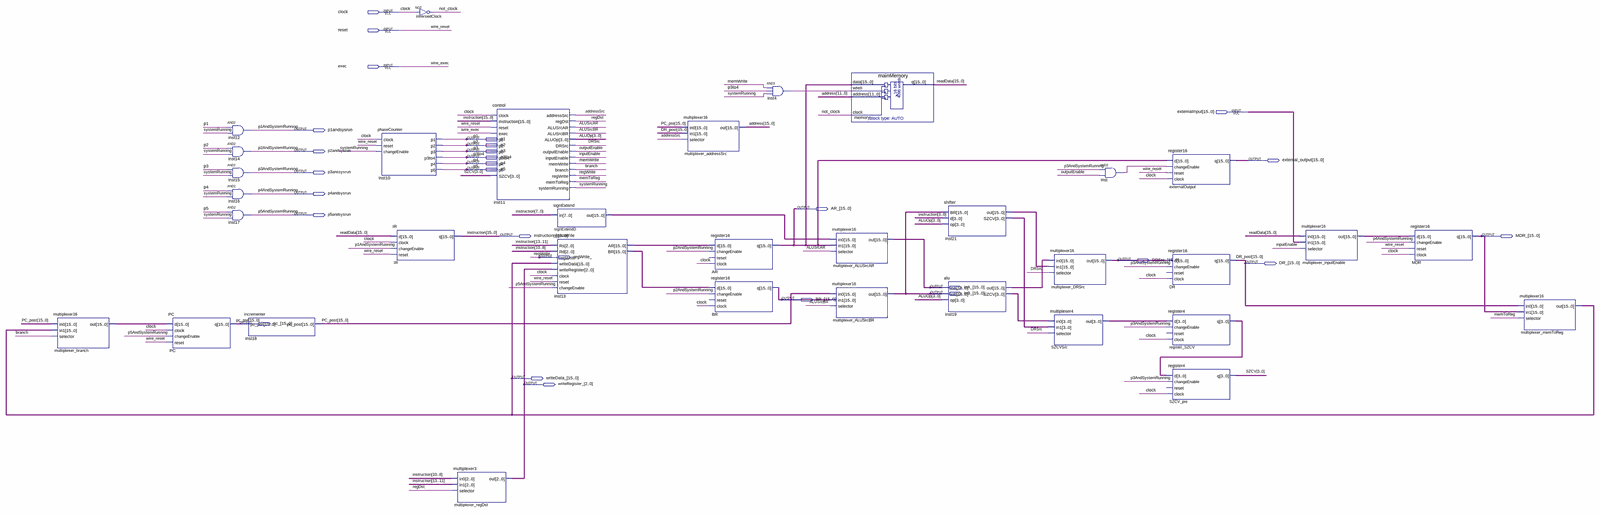
[diagram p0: schematic sheet, whole]
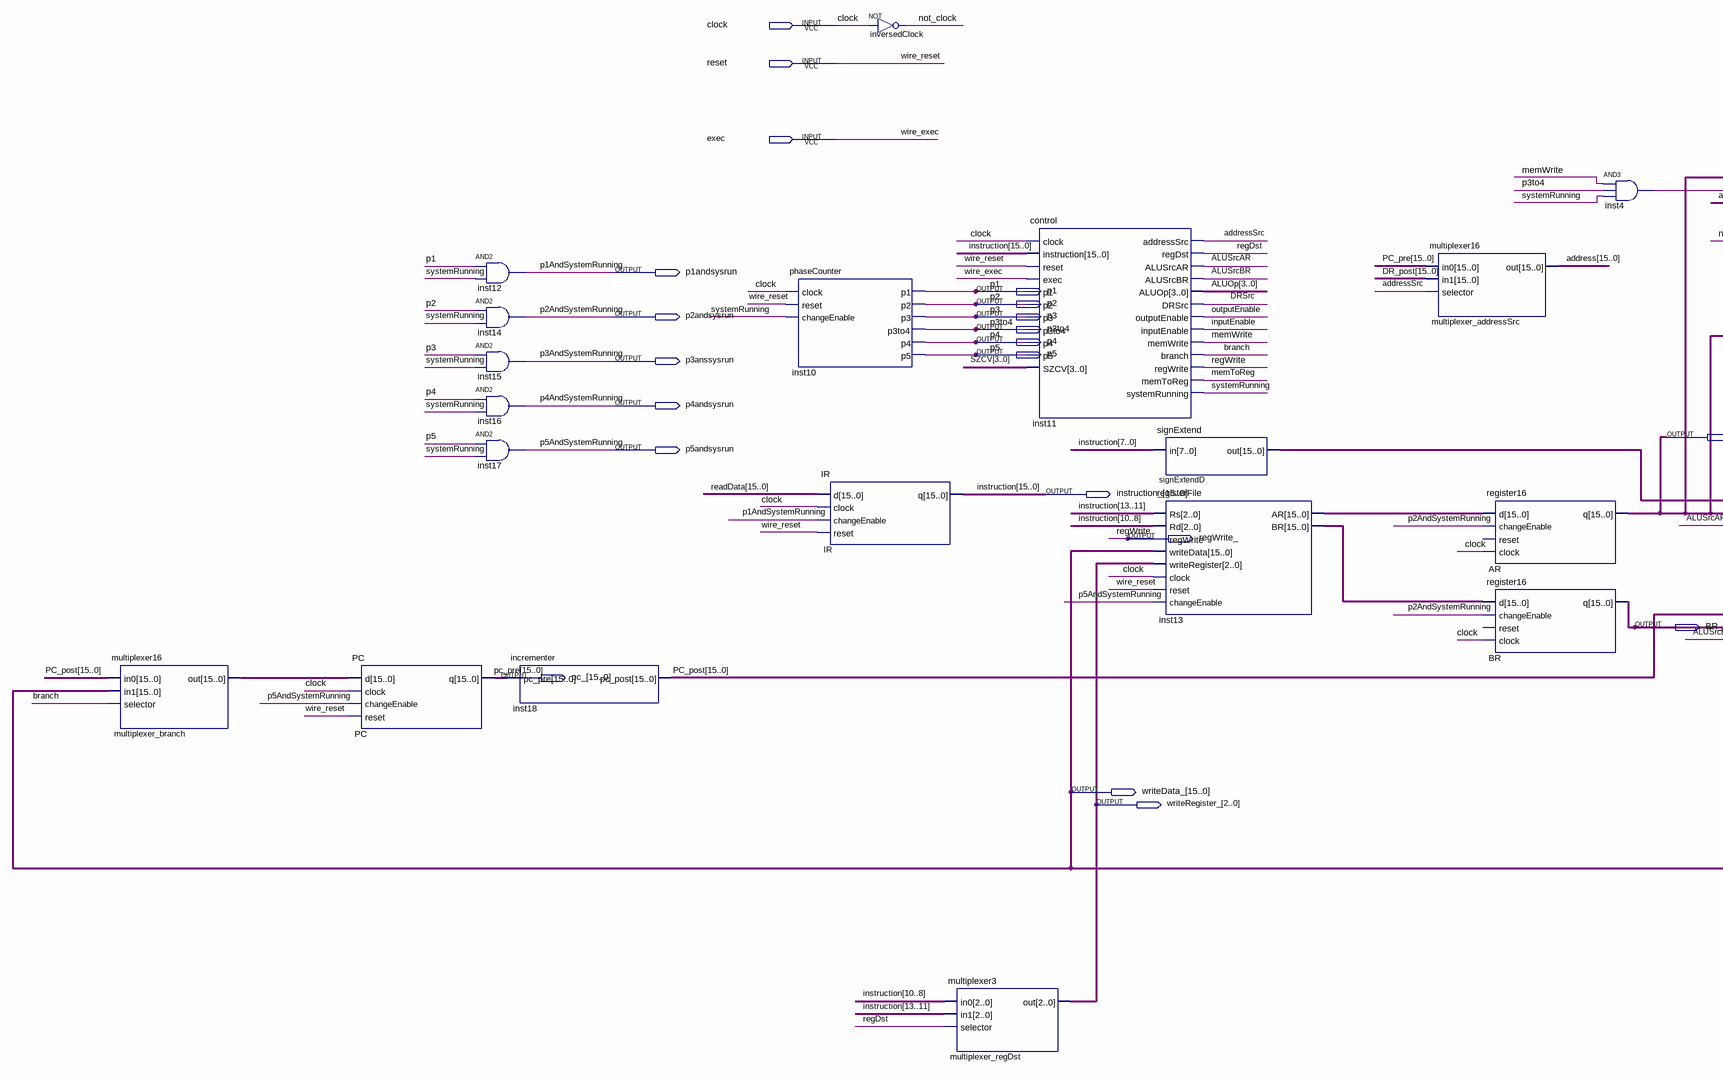
[diagram p1: schematic sheet, left part]
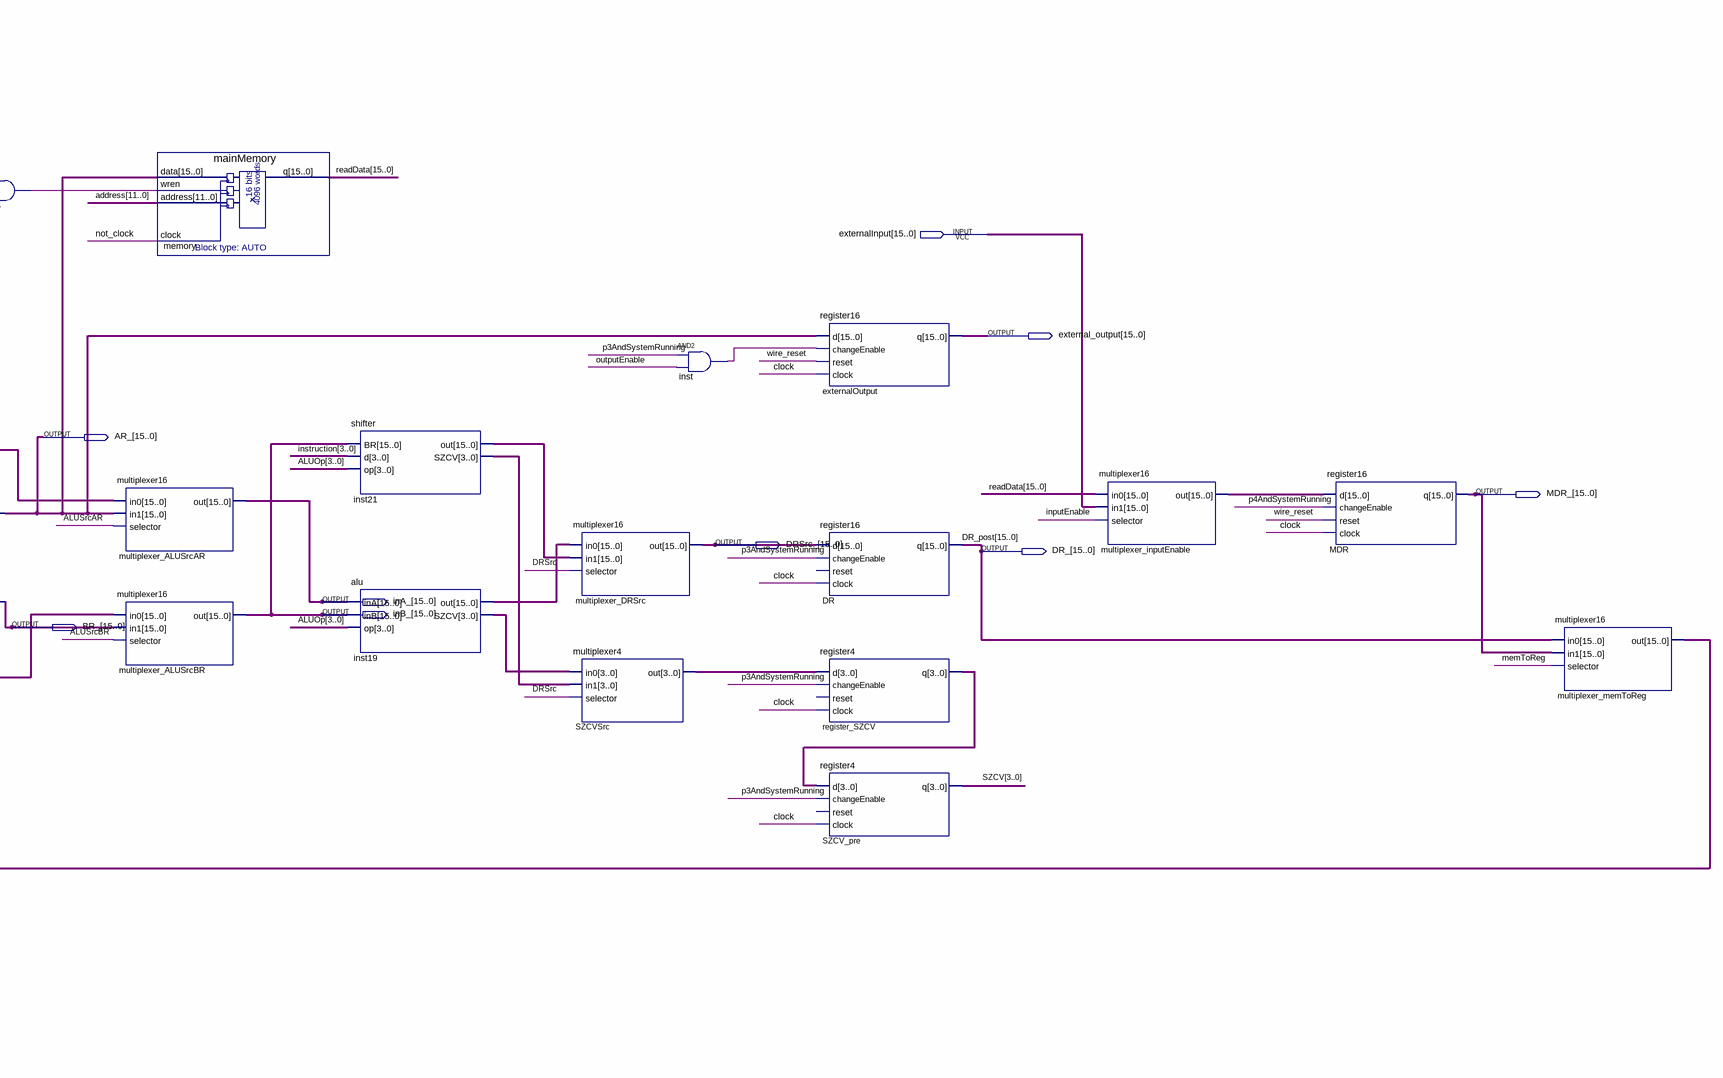
[diagram p2: schematic sheet, right part]
// Quartus schematic processor.bdf as structural Verilog: 34 symbols, 28 pins
module processor (
  input  clock,
  input  reset,
  input  exec,
  input  [15:0] externalInput,
  output p1andsysrun,
  output p1,
  output p2,
  output p2andsysrun,
  output p3,
  output p3to4,
  output [15:0] external_output,
  output p4,
  output p5,
  output p3anssysrun,
  output p4andsysrun,
  output [15:0] AR_,
  output p5andsysrun,
  output [15:0] instruction_,
  output [15:0] MDR_,
  output regWrite_,
  output [15:0] DRSrc_,
  output [15:0] DR_,
  output [15:0] inA_,
  output [15:0] inB_,
  output [15:0] BR_,
  output [15:0] pc_,
  output [15:0] writeData_,
  output [2:0] writeRegister_
);

  wire addressSrc, ALUSrcAR, ALUSrcBR, branch, DRSrc, inputEnable, inst4_out, inst_out, memToReg, memWrite,
       not_clock, outputEnable, regDst, systemRunning;
  wire [3:0] ALUOp, inst19_szcv, inst21_szcv, register_SZCV_q, SZCV, SZCVSrc_out;
  wire [15:0] address, inst13_ar, inst13_br, inst19_out, inst21_out, multiplexer_branch_out,
       multiplexer_inputEnable_out, PC_post, readData, signExtendD_out;

  multiplexer16 multiplexer_branch (.in0(PC_post), .in1(writeData_), .selector(branch), .out(multiplexer_branch_out));
  PC PC (.d(multiplexer_branch_out), .clock(clock), .changeEnable(p5andsysrun), .reset(reset), .q(pc_));
  and inst12 (p1andsysrun, p1, systemRunning);
  and inst14 (p2andsysrun, p2, systemRunning);
  and inst15 (p3anssysrun, p3, systemRunning);
  and inst16 (p4andsysrun, p4, systemRunning);
  and inst17 (p5andsysrun, p5, systemRunning);
  incrementer inst18 (.pc_pre(pc_), .pc_post(PC_post));
  phaseCounter inst10 (
    .clock(clock), .reset(reset), .changeEnable(systemRunning), .p1(p1), .p2(p2), .p3(p3), .p3to4(p3to4),
    .p4(p4), .p5(p5));
  IR IR (.d(readData), .clock(clock), .changeEnable(p1andsysrun), .reset(reset), .q(instruction_));
  not inversedClock (not_clock, clock);
  multiplexer3 multiplexer_regDst (
    .in0(instruction_[10:8]), .in1(instruction_[13:11]), .selector(regDst), .out(writeRegister_));
  control inst11 (
    .clock(clock), .instruction(instruction_), .reset(reset), .exec(exec), .p1(p1), .p2(p2), .p3(p3),
    .p3to4(p3to4), .p4(p4), .p5(p5), .SZCV(SZCV), .addressSrc(addressSrc), .regDst(regDst),
    .ALUSrcAR(ALUSrcAR), .ALUSrcBR(ALUSrcBR), .ALUOp(ALUOp), .DRSrc(DRSrc), .outputEnable(outputEnable),
    .inputEnable(inputEnable), .memWrite(memWrite), .branch(branch), .regWrite(regWrite_),
    .memToReg(memToReg), .systemRunning(systemRunning));
  signExtend signExtendD (.in(instruction_[7:0]), .out(signExtendD_out));
  registerFile inst13 (
    .Rs(instruction_[13:11]), .Rd(instruction_[10:8]), .regWrite(regWrite_), .writeData(writeData_),
    .writeRegister(writeRegister_), .clock(clock), .reset(reset), .changeEnable(p5andsysrun), .AR(inst13_ar),
    .BR(inst13_br));
  multiplexer16 multiplexer_addressSrc (.in0(pc_), .in1(DR_), .selector(addressSrc), .out(address));
  register16 AR (.d(inst13_ar), .changeEnable(p2andsysrun), .clock(clock), .q(AR_));  // open: reset
  register16 BR (.d(inst13_br), .changeEnable(p2andsysrun), .clock(clock), .q(BR_));  // open: reset
  and inst4 (inst4_out, memWrite, p3to4, systemRunning);
  multiplexer16 multiplexer_ALUSrcAR (.in0(signExtendD_out), .in1(AR_), .selector(ALUSrcAR), .out(inA_));
  multiplexer16 multiplexer_ALUSrcBR (.in0(PC_post), .in1(BR_), .selector(ALUSrcBR), .out(inB_));
  mainMemory memory (.data(AR_), .wren(inst4_out), .address(address[11:0]), .clock(not_clock), .q(readData));
  shifter inst21 (.BR(inB_), .d(instruction_[3:0]), .op(ALUOp), .out(inst21_out), .SZCV(inst21_szcv));
  alu inst19 (.inA(inA_), .inB(inB_), .op(ALUOp), .out(inst19_out), .SZCV(inst19_szcv));
  multiplexer16 multiplexer_DRSrc (.in0(inst19_out), .in1(inst21_out), .selector(DRSrc), .out(DRSrc_));
  multiplexer4 SZCVSrc (.in0(inst19_szcv), .in1(inst21_szcv), .selector(DRSrc), .out(SZCVSrc_out));
  and inst (inst_out, p3anssysrun, outputEnable);
  register16 externalOutput (.d(AR_), .changeEnable(inst_out), .reset(reset), .clock(clock), .q(external_output));
  register16 DR (.d(DRSrc_), .changeEnable(p3anssysrun), .clock(clock), .q(DR_));  // open: reset
  register4 register_SZCV (
    .d(SZCVSrc_out), .changeEnable(p3anssysrun), .clock(clock), .q(register_SZCV_q));  // open: reset
  register4 SZCV_pre (.d(register_SZCV_q), .changeEnable(p3anssysrun), .clock(clock), .q(SZCV));  // open: reset
  multiplexer16 multiplexer_inputEnable (
    .in0(readData), .in1(externalInput), .selector(inputEnable), .out(multiplexer_inputEnable_out));
  register16 MDR (.d(multiplexer_inputEnable_out), .changeEnable(p4andsysrun), .reset(reset), .clock(clock), .q(MDR_));
  multiplexer16 multiplexer_memToReg (.in0(DR_), .in1(MDR_), .selector(memToReg), .out(writeData_));

  // Other names for the same wires on the sheet: DR_post[15:0] = DR_; instruction[15:0] = instruction_;
  //   p1AndSystemRunning = p1andsysrun; p2AndSystemRunning = p2andsysrun; p3AndSystemRunning = p3anssysrun;
  //   p4AndSystemRunning = p4andsysrun; p5AndSystemRunning = p5andsysrun; PC_pre[15:0] = pc_; regWrite = regWrite_;
  //   wire_exec = exec; wire_reset = reset
endmodule
